# EAGLE design RAM_64K (EAGLE 7.7.0)
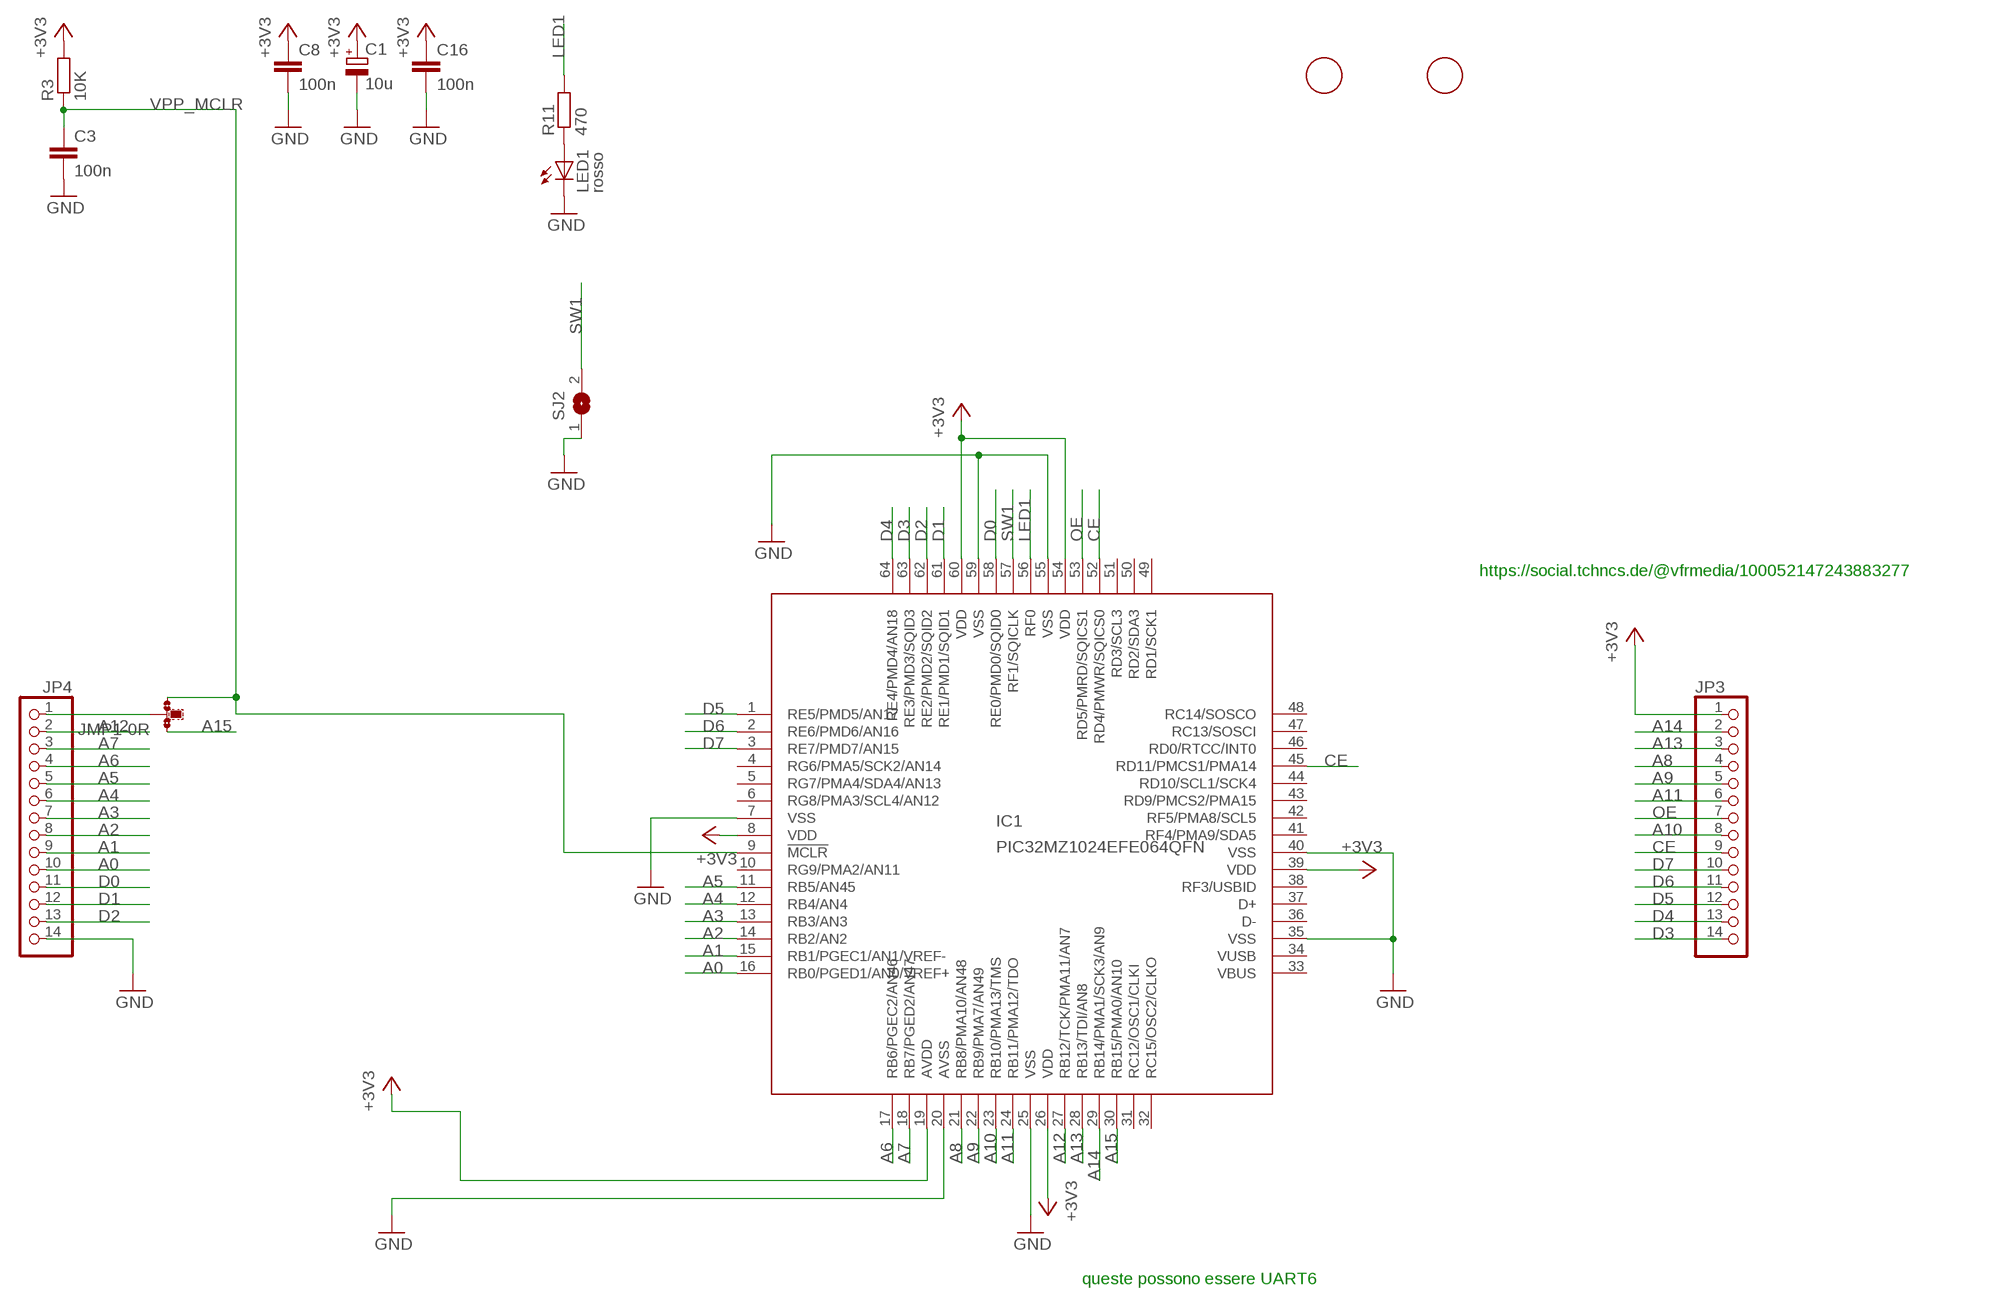
[diagram p0: schematic, sheet 1]

## Parts
C1  10u  CPOL-EUSMCB  [SMC_B]
C3  100n  C-EUC0805  [C0805]
C8  100n  C-EUC0805  [C0805]
C16  100n  C-EUC0805  [C0805]
F1  FIDUCIAL  [FIDUCIAL_1MM]
F2  FIDUCIAL  [FIDUCIAL_1MM]
IC1  PIC32MZ1024EFE064QFN  [QFN64]
JMP1  0R-JUMPC  [C0R-JMP]
JP3  PINHD-1X14_2.54  [1X14]
JP4  PINHD-1X14_2.54  [1X14]
LED1  rosso  LEDCHIPLED_0805  [CHIPLED_0805]
R3  10K  R-EU_R0805  [R0805]
R11  470  R-EU_R0805  [R0805]
SJ2  SJ  [SJ]

## Nets
+3V3: C1.+ C8.1 C16.1 IC1.8(VDD) IC1.19(AVDD) IC1.26(VDD) IC1.39(VDD) IC1.54(VDD) IC1.60(VDD) JP3.1 R3.2
A0: IC1.16(RB0/PGED1/AN0/VREF+) JP4.10
A1: IC1.15(RB1/PGEC1/AN1/VREF-) JP4.9
A2: IC1.14(RB2/AN2) JP4.8
A3: IC1.13(RB3/AN3) JP4.7
A4: IC1.12(RB4/AN4) JP4.6
A5: IC1.11(RB5/AN45) JP4.5
A6: IC1.17(RB6/PGEC2/AN46) JP4.4
A7: IC1.18(RB7/PGED2/AN47) JP4.3
A8: IC1.21(RB8/PMA10/AN48) JP3.4
A9: IC1.22(RB9/PMA7/AN49) JP3.5
A10: IC1.23(RB10/PMA13/TMS) JP3.8
A11: IC1.24(RB11/PMA12/TDO) JP3.6
A12: IC1.27(RB12/TCK/PMA11/AN7) JP4.2
A13: IC1.28(RB13/TDI/AN8) JP3.3
A14: IC1.29(RB14/PMA1/SCK3/AN9) JP3.2
A15: IC1.30(RB15/PMA0/AN10) JMP1.1
CE: IC1.45(RD11/PMCS1/PMA14) IC1.52(RD4/PMWR/SQICS0) JP3.9
D0: IC1.58(RE0/PMD0/SQID0) JP4.11
D1: IC1.61(RE1/PMD1/SQID1) JP4.12
D2: IC1.62(RE2/PMD2/SQID2) JP4.13
D3: IC1.63(RE3/PMD3/SQID3) JP3.14
D4: IC1.64(RE4/PMD4/AN18) JP3.13
D5: IC1.1(RE5/PMD5/AN17) JP3.12
D6: IC1.2(RE6/PMD6/AN16) JP3.11
D7: IC1.3(RE7/PMD7/AN15) JP3.10
GND: C1.- C3.2 C8.2 C16.2 IC1.7(VSS) IC1.20(AVSS) IC1.25(VSS) IC1.35(VSS) IC1.40(VSS) IC1.55(VSS) IC1.59(VSS) JP4.14 LED1.C SJ2.1
LED1: IC1.56(RF0) R11.2
N$1: JMP1.2 JP4.1
N$7: LED1.A R11.1
OE: IC1.53(RD5/PMRD/SQICS1) JP3.7
SW1: IC1.57(RF1/SQICLK) SJ2.2
VPP_MCLR: C3.1 IC1.9(!MCLR) JMP1.3 R3.1
Unconnected: IC1.4(RG6/PMA5/SCK2/AN14) IC1.5(RG7/PMA4/SDA4/AN13) IC1.6(RG8/PMA3/SCL4/AN12) IC1.10(RG9/PMA2/AN11) IC1.31(RC12/OSC1/CLKI) IC1.32(RC15/OSC2/CLKO) IC1.33(VBUS) IC1.36(D-) IC1.37(D+) IC1.38(RF3/USBID) IC1.41(RF4/PMA9/SDA5) IC1.42(RF5/PMA8/SCL5) IC1.43(RD9/PMCS2/PMA15) IC1.44(RD10/SCL1/SCK4) IC1.46(RD0/RTCC/INT0) IC1.47(RC13/SOSCI) IC1.48(RC14/SOSCO) IC1.49(RD1/SCK1) IC1.50(RD2/SDA3) IC1.51(RD3/SCL3)

## Notes on the sheet
- https://social.tchncs.de/@vfrmedia/100052147243883277
- queste possono essere UART6

## Power pins joined to a net without a drawn wire
VUSB: IC1.34(VUSB)

## Library data of the parts
C1 = resistor:CPOL-EU: POLARIZED CAPACITOR, European symbol
C3 C8 C16 = resistor:C-EU: CAPACITOR, European symbol
F1 F2 = adafruit:FIDUCIAL: For use by pick and place machines to calibrate the vision/machine, 1mm By microbuilder.eu
IC1 = microchip2:PIC32MZ1024EFE064: PIC32MX340FxxxH Source: http://ww1.microchip.com/downloads/en/DeviceDoc/61143E.pdf, PIC32MZ1024EFE064.bsdl
JMP1 = jump-0r-smd:0R-JUMP: SMD 0R 0805 Jumper
JP3 JP4 = pinhead-2:PINHD-1X14: PIN HEADER
LED1 = led:LED: LED OSRAM: - CHIPLED LG R971, LG N971, LY N971, LG Q971, LY Q971, LO R971, LY R971 LH N974, LH R974 LS Q976, LO Q976, LY Q976 LO Q996 - Hyper CHIPLED LW Q18S LB Q993, LB Q99A, LB R99A - SideLED LS A670, LO A670, LY A670, LG A670, LP A670 LB A673, LV A673, LT A673, LW A673 LH A674 LY A675 LS A676, LA A676, LO A676, LY A676, LW A676 LS A679, LY A679, LG A679 - Hyper Micro SIDELED® LS Y876, LA Y876, LO Y876, LY Y876 LT Y87S - SmartLED LW L88C, LW L88S LB L89C, LB L89S, LG L890 LS L89K, LO L89K, LY L89K LS L896, LA L896, LO L896, LY L896 - TOPLED LS T670, LO T670, LY T670, LG T670, LP T670 LSG T670, LSP T670, LSY T670, LOP T670, LYG T670 LG T671, LOG T671, LSG T671 LB T673, LV T673, LT T673, LW T673 LH T674 LS T676, LA T676, LO T676, LY T676, LB T676, LH T676, LSB T676, LW T676 LB T67C, LV T67C, LT T67C, LS T67K, LO T67K, LY T67K, LW E67C LS E67B, LA E67B, LO E67B, LY E67B, LB E67C, LV E67C, LT E67C LW T67C LS T679, LY T679, LG T679 LS T770, LO T770, LY T770, LG T770, LP T770 LB T773, LV T773, LT T773, LW T773 LH T774 LS E675, LA E675, LY E675, LS T675 LS T776, LA T776, LO T776, LY T776, LB T776 LHGB T686 LT T68C, LB T68C - Hyper Mini TOPLED® LB M676 - Mini TOPLED Santana® LG M470 LS M47K, LO M47K, LY M47K Source: http://www.osram.convergy.de LUXEON: - LUMILED® LXK2-PW12-R00, LXK2-PW12-S00, LXK2-PW14-U00, LXK2-PW14-V00 LXK2-PM12-R00, LXK2-PM12-S00, LXK2-PM14-U00 LXK2-PE12-Q00, LXK2-PE12-R00, LXK2-PE12-S00, LXK2-PE14-T00, LXK2-PE14-U00 LXK2-PB12-K00, LXK2-PB12-L00, LXK2-PB12-M00, LXK2-PB14-N00, LXK2-PB14-P00, LXK2-PB14-Q00 LXK2-PR12-L00, LXK2-PR12-M00, LXK2-PR14-Q00, LXK2-PR14-R00 LXK2-PD12-Q00, LXK2-PD12-R00, LXK2-PD12-S00 LXK2-PH12-R00, LXK2-PH12-S00 LXK2-PL12-P00, LXK2-PL12-Q00, LXK2-PL12-R00 Source: www.luxeon.com KINGBRIGHT: KA-3528ASYC Source: www.kingbright.com
R3 R11 = resistor:R-EU_: RESISTOR, European symbol
SJ2 = jumper:SJ: SMD solder JUMPER

## Net classes
2 N2: width 0.33 mm, clearance 0.762 mm
3 N3: width 0.33 mm
4 N4: width 0.33 mm

## Board
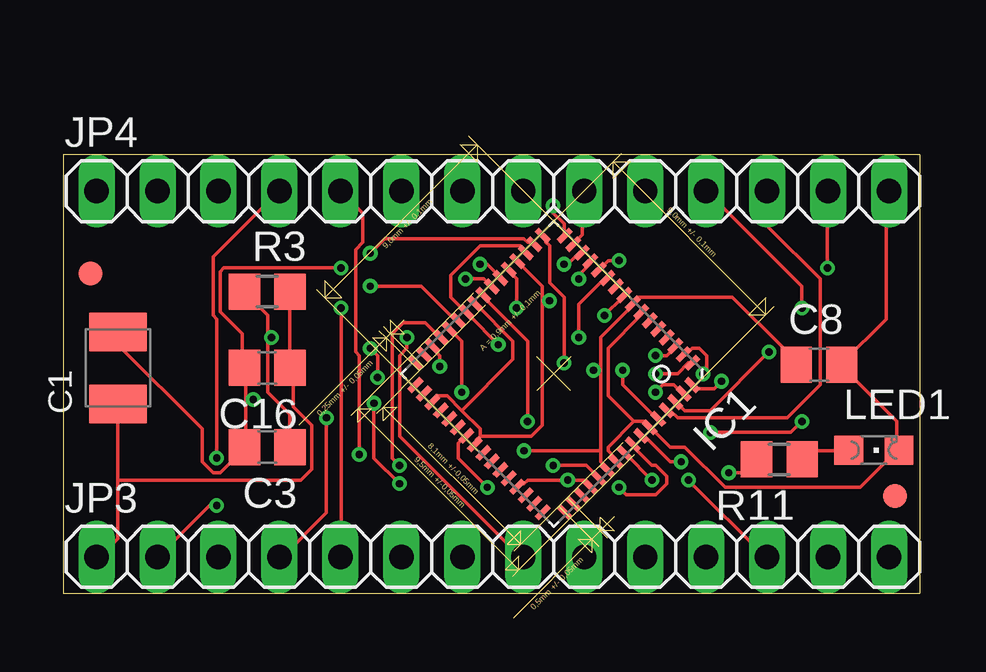
[diagram p1: board, top side]
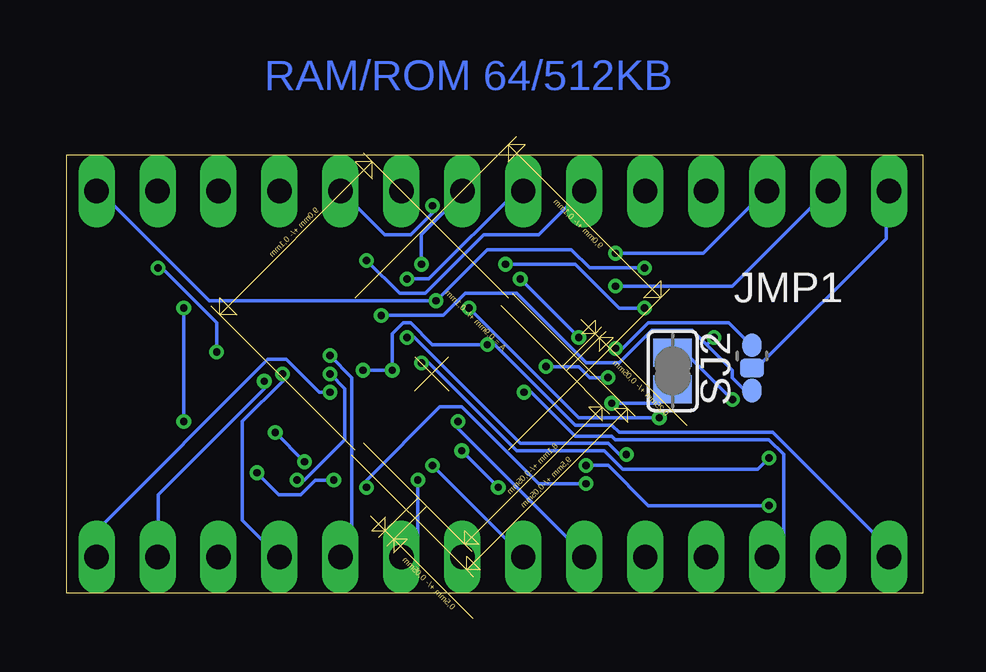
[diagram p2: board, bottom side, seen from below]

Size 35.69 x 18.28 mm. Coordinates in mm from the lower left corner, seen from the top.
Outline: 0,0 35.69,0 35.69,18.28 0,18.28 0,0
Copper layers (1*16): Top 0.035mm / dielectric 1.5mm / Bottom 0.035mm
Design rules "SeeedStudio_2layer_DRU_no_angle_20140221": minimum track width 6mil, minimum drill 12mil, track to track 6mil, track to pad 6mil, pad to pad 6mil, via to via 6mil, smd to smd 0mil, copper to edge 10mil, drill to drill 10mil, minimum pad ring 10mil, minimum via ring 6mil, stop-mask expansion 2mil, vias tented up to drill 100mil, thermal gap 10mil

### Footprints (pad centres in the part's own frame; a part is rotated, then mirrored left to right if it is on the bottom)
SMC_B = smd 1.6 x 2.4: + -1.5,0; - 1.5,0
C0805 = smd 1.3 x 1.5: 1 -0.95,0; 2 0.95,0
FIDUCIAL_1MM = smd 1 x 1: 1 0,0
QFN64 = smd 0.7 x 0.25: 1 -4.4,3.75; 2 -4.4,3.25; 3 -4.4,2.75; 4 -4.4,2.25; 5 -4.4,1.75; 6 -4.4,1.25; 7 -4.4,0.75; 8 -4.4,0.25; 9 -4.4,-0.25; 10 -4.4,-0.75; 11 -4.4,-1.25; 12 -4.4,-1.75; 13 -4.4,-2.25; 14 -4.4,-2.75; 15 -4.4,-3.25; 16 -4.4,-3.75; 33 4.4,-3.75; 34 4.4,-3.25; 35 4.4,-2.75; 36 4.4,-2.25; 37 4.4,-1.75; 38 4.4,-1.25; 39 4.4,-0.75; 40 4.4,-0.25; 41 4.4,0.25; 42 4.4,0.75; 43 4.4,1.25; 44 4.4,1.75; 45 4.4,2.25; 46 4.4,2.75; 47 4.4,3.25; 48 4.4,3.75 | smd 0.25 x 0.7: 17 -3.75,-4.4; 18 -3.25,-4.4; 19 -2.75,-4.4; 20 -2.25,-4.4; 21 -1.75,-4.4; 22 -1.25,-4.4; 23 -0.75,-4.4; 24 -0.25,-4.4; 25 0.25,-4.4; 26 0.75,-4.4; 27 1.25,-4.4; 28 1.75,-4.4; 29 2.25,-4.4; 30 2.75,-4.4; 31 3.25,-4.4; 32 3.75,-4.4; 49 3.75,4.4; 50 3.25,4.4; 51 2.75,4.4; 52 2.25,4.4; 53 1.75,4.4; 54 1.25,4.4; 55 0.75,4.4; 56 0.25,4.4; 57 -0.25,4.4; 58 -0.75,4.4; 59 -1.25,4.4; 60 -1.75,4.4; 61 -2.25,4.4; 62 -2.75,4.4; 63 -3.25,4.4; 64 -3.75,4.4
C0R-JMP = smd 0.8 x 1: 1 0,0.938; 3 0,-0.938 | smd 1 x 0.8: 2 0,0
1X14 = drill 1.016 long: 1 -16.51,0; 2 -13.97,0; 3 -11.43,0; 4 -8.89,0; 5 -6.35,0; 6 -3.81,0; 7 -1.27,0; 8 1.27,0; 9 3.81,0; 10 6.35,0; 11 8.89,0; 12 11.43,0; 13 13.97,0; 14 16.51,0
CHIPLED_0805 = smd 1.2 x 1.2: A 0,-1.05; C 0,1.05
R0805 = smd 1.3 x 1.5: 1 -0.95,0; 2 0.95,0
SJ = smd 1.168 x 1.6: 1 -0.762,0; 2 0.762,0

### Placement (x,y rotation side)
C1  2.29,9.4 90 top
C3  8.51,6.1 180 top
C8  31.5,9.53 0 top
C16  8.51,9.4 180 top
F1  1.14,13.34 0 top
F2  34.67,4.06 0 top
IC1  20.45,9.14 225 top
JMP1  7.11,9.4 0 bottom
JP3  17.91,1.52 0 top
JP4  17.91,16.76 0 top
LED1  33.78,5.97 270 top
R3  8.51,12.57 0 top
R11  29.84,5.59 180 top
SJ2  10.41,9.27 270 bottom

### Tracks (layer width: path | path; a pad name or v marks a point on that pad's centre or on a via)
+3V3  (via drill 0.3)
  Top 0.152: R3.2 9.45,12.5 9.45,9.45 C16.1 9.6,9.3 9.6,7.77 10.36,7.01 10.36,5.18 9.91,4.72 2.29,4.72 | 2.29,4.72 2.29,2.29 1.52,1.52 JP3.1 | 2.29,4.72 C1.+ | IC1.19 19.2,14.33 19.05,14.48 17.37,14.48 16.15,13.26 16.15,12.34 16.76,11.73 IC1.26 16.92,11.58 v18.14,10.36 | 22.4,9.3 22.4,10.67 23.77,12.04 IC1.8 23.77,12.19 23.93,12.34 27.89,12.34 30.02,10.21 30.02,10.06 30.48,9.6 C8.1 | 22.4,9.3 22.4,5.94 | 22.4,5.94 22.4,5.49 22.55,5.33 22.55,5.18 IC1.54 | v17.68,4.42 16.46,5.64 16.46,6.25 16.76,6.55 IC1.39 | 22.4,5.94 v19.2,5.94 | v23.32,9.3 23.32,8.69 24.69,7.32 IC1.60 | 22.4,9.3 v22.1,9.3
  Bottom 0.152: v19.2,5.94 v17.68,4.42 | v23.32,9.3 v22.1,9.3 22.1,10.82 21.64,11.28 21.34,11.28 20.42,10.36 v18.14,10.36 17.83,10.36 14.48,7.01 12.95,7.01 12.65,6.71 6.25,6.71 1.52,1.98 1.52,1.52 JP3.1
A0  (via drill 0.3)
  Top 0.152: v20.42,16.15 20.42,15.85 20.88,15.39 20.88,14.94 IC1.16
  Bottom 0.152: v20.42,16.15 20.42,15.85 21.34,14.94 22.4,14.94 24.23,16.76 JP4.10
A1
  Top 0.152: IC1.15 21.34,14.63 21.64,14.94 21.64,16.76 JP4.9
A2  (via drill 0.3)
  Top 0.152: v20.88,13.72 21.03,13.72 21.49,14.17 IC1.14
  Bottom 0.152: v20.88,13.72 20.88,14.94 19.05,16.76 JP4.8
A3  (via drill 0.3)
  Top 0.152: v21.49,13.11 21.49,13.26 21.95,13.72 IC1.13
  Bottom 0.152: v21.49,13.11 20.57,13.11 16.92,16.76 JP4.7
A4  (via drill 0.3)
  Top 0.152: v23.16,13.87 22.71,13.87 22.4,13.56 IC1.12
  Bottom 0.152: v23.16,13.87 21.79,12.5 20.73,12.5 18.29,14.94 16,14.94 14.17,16.76 JP4.6
A5  (via drill 0.3)
  Top 0.152: v21.49,10.67 21.49,12.04 22.55,13.11 IC1.11 | v12.34,5.79 12.34,9.91 12.19,10.06 12.19,14.33 12.5,14.63 12.5,15.85 11.58,16.76 JP4.5
  Bottom 0.152: v21.49,10.67 21.18,10.67 16.76,6.25 13.11,6.25 12.65,5.79 v12.34,5.79
A6  (via drill 0.3)
  Top 0.152: v20.88,9.6 20.88,12.34 20.27,12.95 20.27,14.48 20.12,14.63 20.12,14.78 IC1.17 | v6.4,5.64 6.4,11.43 6.25,11.58 6.25,14.02 8.99,16.76 JP4.4
  Bottom 0.152: v20.88,9.6 20.57,9.6 16.92,5.94 13.26,5.94 12.5,5.18 6.86,5.18 v6.4,5.64
A7  (via drill 0.3)
  Top 0.152: v12.8,14.17 13.41,14.78 19.2,14.78 19.36,14.63 19.51,14.63 IC1.18
  Bottom 0.152: v12.8,14.17 9.14,14.17 6.55,16.76 JP4.3
A8  (via drill 0.3)
  Top 0.152: v18.9,11.89 18.9,13.11 18.59,13.41 IC1.21 | v10.97,7.32 10.97,3.35 9.14,1.52 JP3.4
  Bottom 0.152: v18.9,11.89 14.33,7.32 v10.97,7.32
A9  (via drill 0.3)
  Top 0.152: v17.37,13.72 17.68,13.72 18.14,13.26 IC1.22 | v11.58,11.89 11.58,1.52 JP3.5
  Bottom 0.152: v17.37,13.72 14.48,13.72 12.65,11.89 v11.58,11.89
A10  (via drill 0.3)
  Top 0.152: v16.76,13.11 17.53,13.11 17.83,12.8 IC1.23 | v14.33,10.67 14.33,10.21 14.02,9.91 14.02,6.55 19.05,1.52 JP3.8
  Bottom 0.152: v14.33,10.67 v16.76,13.11
A11  (via drill 0.3)
  Top 0.152: v19.36,7.16 19.36,10.52 17.53,12.34 IC1.24
  Bottom 0.152: v19.36,7.16 19.36,6.86 14.02,1.52 JP3.6
A12  (via drill 0.3)
  Top 0.152: v12.8,12.8 14.94,12.8 16.31,11.43 IC1.27
  Bottom 0.152: v12.8,12.8 7.92,12.8 3.96,16.76 JP4.2
A13  (via drill 0.3)
  Top 0.152: v16.61,8.38 16.61,10.52 16.15,10.97 IC1.28
  Bottom 0.152: v16.61,8.38 16.31,8.38 14.48,6.55 12.95,6.55 12.8,6.4 6.4,6.4 5.79,5.79 5.79,2.13 6.4,1.52 JP3.3
A14  (via drill 0.3)
  Top 0.152: v14.02,5.33 13.72,5.64 13.72,10.82 14.17,11.28 15.09,11.28 15.7,10.67 IC1.29 | v6.4,3.66 6.1,3.66 3.96,1.52 JP3.2
  Bottom 0.152: v14.02,5.33 13.11,5.33 11.43,3.66 v6.4,3.66
A15  (via drill 0.3)
  Top 0.152: v15.7,9.45 15.7,9.91 15.39,10.21 IC1.30 | v13.11,8.99 13.11,9.91 v12.8,10.21
  Bottom 0.152: v15.7,9.45 14.33,9.45 13.87,8.99 v13.11,8.99 | v12.8,10.21 12.5,10.21 11.43,11.28 8.08,11.28 7.16,10.36 JMP1.1
CE  (via drill 0.3)
  Top 0.152: IC1.45 19.05,4.57 19.2,4.57 19.36,4.72 v21.03,4.72 21.79,4.72 21.95,4.57 IC1.52
  Bottom 0.152: v21.03,4.72 21.03,2.13 21.64,1.52 JP3.9
D0  (via drill 0.3)
  Top 0.152: v25.76,5.49 25.3,5.49 24.23,6.55 IC1.58 | v26.98,6.71 30.33,6.71 v30.79,7.16 | v30.79,11.89 30.79,12.8 26.82,16.76 JP4.11
  Bottom 0.152: v26.98,6.71 v25.76,5.49 | v30.79,11.89 v30.79,7.16
D1
  Top 0.152: IC1.61 25.3,7.62 25.6,7.32 30.18,7.32 31.55,8.69 31.55,13.11 29.41,15.24 29.41,16.76 JP4.12
D2  (via drill 0.3)
  Top 0.152: v29.41,10.06 26.98,7.62 25.91,7.62 25.6,7.92 IC1.62 | v31.85,13.56 31.85,16.76 JP4.13
  Bottom 0.152: v29.41,10.06 29.41,11.28 31.7,13.56 v31.85,13.56
D3  (via drill 0.3)
  Top 0.152: v24.69,8.38 24.99,8.69 25.45,8.69 25.76,8.38 IC1.63
  Bottom 0.152: v24.69,8.38 25.15,8.38 26.52,9.75 27.28,9.75 34.29,2.74 34.29,1.52 JP3.14
D4  (via drill 0.3)
  Top 0.152: v27.43,8.84 27.13,8.53 26.21,8.53 IC1.64
  Bottom 0.152: v27.43,8.84 27.43,8.53 31.85,4.12 31.85,1.52 JP3.13
D5  (via drill 0.3)
  Top 0.152: v24.69,9.14 25.6,9.14 26.06,9.6 IC1.1 | v26.06,4.72 29.26,1.52 JP3.12
  Bottom 0.152: v24.69,9.14 24.08,8.53 24.08,6.4 25.76,4.72 v26.06,4.72
D6  (via drill 0.3)
  Top 0.152: v26.67,9.14 26.82,9.3 26.82,9.91 26.52,10.21 26.21,10.21 26.06,10.06 25.91,10.06 IC1.2
  Bottom 0.152: v26.67,9.14 26.67,8.84 28.35,7.16 28.35,3.05 26.82,1.52 JP3.11
D7  (via drill 0.3)
  Top 0.152: v24.69,9.91 25.15,9.91 25.45,10.21 IC1.3
  Bottom 0.152: v24.69,9.91 23.77,8.99 23.77,1.98 24.23,1.52 JP3.10
GND  (via drill 0.3)
  Top 0.152: 7.62,8.08 7.62,9.3 C16.2 7.47,9.45 7.47,10.82 6.55,11.73 6.55,13.41 6.71,13.56 v11.58,13.56 | 7.62,8.08 7.62,6.1 | 7.62,8.08 v7.92,8.08 | C1.- 2.29,10.36 5.79,6.86 5.79,5.49 6.25,5.03 6.55,5.03 7.62,6.1 | 7.62,6.1 C3.2 | 17.37,6.55 17.22,6.4 17.22,6.25 IC1.40 | 17.37,6.55 17.37,6.86 16.61,7.62 | 16.61,7.62 16,8.23 15.54,8.23 15.39,8.08 IC1.35 | 16.61,7.62 18.75,9.75 18.75,10.52 17.22,12.04 IC1.25 | 19.96,12.19 19.96,7.01 19.51,6.55 17.37,6.55 | 19.96,12.19 19.96,12.8 19.05,13.72 IC1.20 | 23.77,7.16 22.71,6.1 22.71,5.94 23.01,5.64 IC1.55 | 23.77,7.16 24.23,7.16 24.38,7.01 IC1.59 24.54,6.86 25.3,6.1 25.91,6.1 27.58,4.42 33.22,4.42 34.75,5.94 LED1.C 34.75,6.1 34.75,7.16 32.46,9.45 C8.2 32.46,9.6 34.29,11.43 34.29,16.76 JP4.14 | 23.77,7.16 22.71,8.23 22.71,10.21 24.08,11.58 IC1.7 | v20.27,12.19 19.96,12.19
  Bottom 0.152: v7.92,8.08 9.75,9.91 10.36,9.91 SJ2.1 | JP4.14 34.29,16.76 29.72,12.19 v20.27,12.19 18.14,14.33 14.63,14.33 13.87,13.56 v11.58,13.56
LED1  (via drill 0.3)
  Top 0.152: v24.54,4.72 23.47,5.79 IC1.56 | v27.74,5.03 28.35,5.03 28.8,5.49 R11.2
  Bottom 0.152: v24.54,4.72 25.3,4.72 25.91,4.12 26.82,4.12 v27.74,5.03
N$1
  Bottom 0.152: JMP1.2 7.01,9.45 6.86,9.45 1.52,14.78 1.52,16.76 JP4.1
N$7
  Top 0.152: LED1.A 32.61,5.94 31.24,5.94 30.94,5.64 R11.1
OE  (via drill 0.3)
  Top 0.152: v20.42,5.33 21.79,5.33 22.25,4.88 IC1.53
  Bottom 0.152: v20.42,5.33 16.61,1.52 JP3.7
SW1  (via drill 0.3)
  Top 0.152: v23.16,4.42 23.47,4.12 24.69,4.12 25.15,4.57 25.15,4.88 24.69,5.33 24.54,5.33 23.77,6.1 IC1.57 | v14.02,4.57 12.95,5.64 v12.95,7.92
  Bottom 0.152: v23.16,4.42 23.16,4.72 20.12,7.77 19.2,7.77 16,4.57 v14.02,4.57 | v12.95,7.92 10.97,7.92 10.52,8.38 SJ2.2
VPP_MCLR  (via drill 0.3)
  Top 0.152: 8.53,10.67 8.53,11.58 7.62,12.5 R3.1 | 8.53,10.67 8.53,8.38 9.45,7.47 C3.1 | v22.55,11.58 23.32,12.34 IC1.9 | v8.69,10.67 8.53,10.67
  Bottom 0.152: v22.55,11.58 19.96,11.58 19.05,12.5 16.92,12.5 14.02,9.6 12.65,9.6 11.28,10.97 9.6,10.97 8.99,10.36 | 8.99,10.36 7.92,9.3 7.92,8.99 7.47,8.53 7.16,8.53 JMP1.3 | 8.99,10.36 v8.69,10.67

### Text on the board
Bottom: RAM/ROM 64/512KB